# EAGLE design r2 (EAGLE 9.6.2)
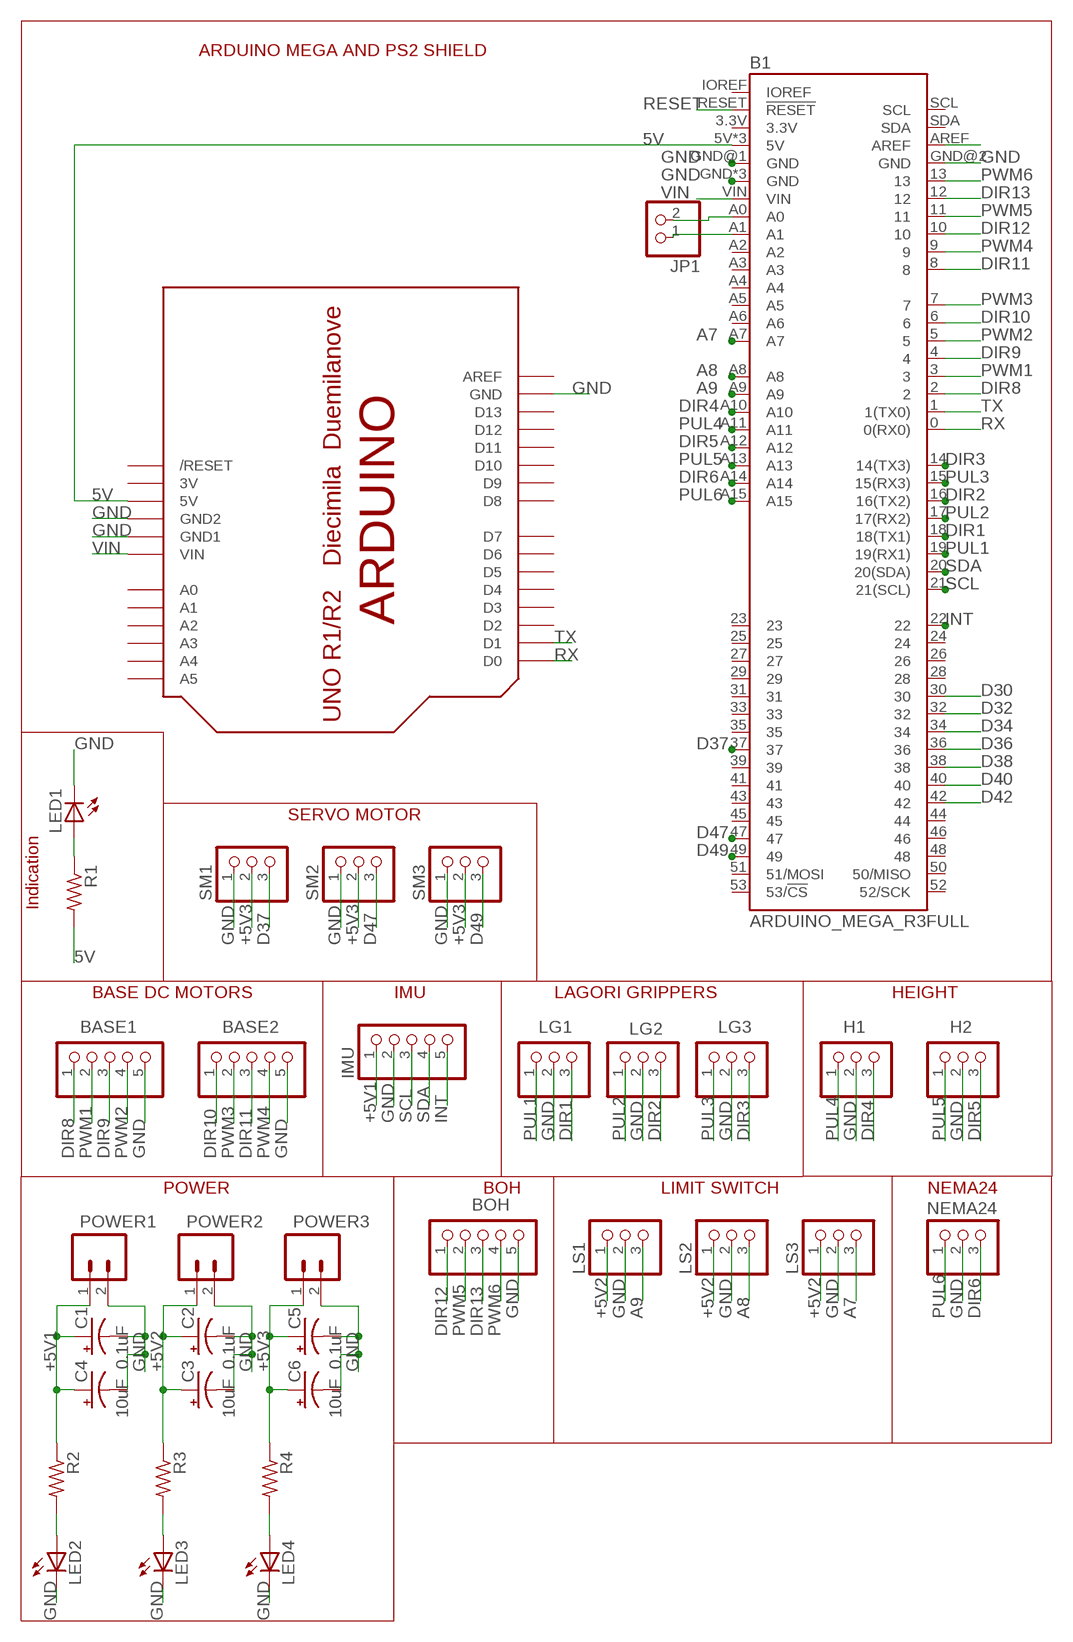
[diagram p0: schematic, sheet 1]

## Parts
B1  ARDUINO_MEGA_R3FULL  [ARDUINO_MEGA_NO_SILK]
BASE1  PINHD-1X5  [1X05]
BASE2  PINHD-1X5  [1X05]
BOH  PINHD-1X5  [1X05]
C1  0.1uF  CPOL-USE2-5  [E2-5]
C2  0.1uF  CPOL-USE2-5  [E2-5]
C3  10uF  CPOL-USE2-5  [E2-5]
C4  10uF  CPOL-USE2-5  [E2-5]
C5  0.1uF  CPOL-USE2-5  [E2-5]
C6  10uF  CPOL-USE2-5  [E2-5]
H1  PINHD-1X3  [1X03]
H2  PINHD-1X3  [1X03]
IMU  PINHD-1X5  [1X05]
JP1  PINHD-1X2  [1X02]
LED1  LED3MM  [LED3MM]
LED2  LED3MM  [LED3MM]
LED3  LED3MM  [LED3MM]
LED4  LED3MM  [LED3MM]
LG1  PINHD-1X3  [1X03]
LG2  PINHD-1X3  [1X03]
LG3  PINHD-1X3  [1X03]
LS1  PINHD-1X3  [1X03]
LS2  PINHD-1X3  [1X03]
LS3  PINHD-1X3  [1X03]
NEMA24  PINHD-1X3  [1X03]
POWER1  CONN_02  [1X02]
POWER2  CONN_02  [1X02]
POWER3  CONN_02  [1X02]
R1  R-US_0204/5  [0204/5]
R2  R-US_0204/5  [0204/5]
R3  R-US_0204/5  [0204/5]
R4  R-US_0204/5  [0204/5]
SM1  PINHD-1X3  [1X03]
SM2  PINHD-1X3  [1X03]
SM3  PINHD-1X3  [1X03]
U$1  ARDUINO-NOHOLE  [ARDUINO-NOHOLE]

## Nets
5V: B1.5V B1.5V@1(5V) B1.5V@2(5V) R1.2 U$1.5V
+5V1: C1.+ C4.+ IMU.1 POWER1.1 R2.1
+5V2: C2.+ C3.+ LS1.1 LS2.1 LS3.1 POWER2.1 R3.1
+5V3: C5.+ C6.+ POWER3.1 R4.1 SM1.2 SM2.2 SM3.2
A7: B1.A7 LS3.3
A8: B1.A8 LS2.3
A9: B1.A9 LS1.3
D30: B1.30
D32: B1.32
D34: B1.34
D36: B1.36
D37: B1.37 SM1.3
D38: B1.38
D40: B1.40
D42: B1.42
D47: B1.47 SM2.3
D49: B1.49 SM3.3
DIR1: B1.18(18(TX1)) LG1.3
DIR2: B1.16(16(TX2)) LG2.3
DIR3: B1.14(14(TX3)) LG3.3
DIR4: B1.A10 H1.3
DIR5: B1.A12 H2.3
DIR6: B1.A14 NEMA24.3
DIR8: B1.2 BASE1.1
DIR9: B1.4 BASE1.3
DIR10: B1.6 BASE2.1
DIR11: B1.8 BASE2.3
DIR12: B1.10 BOH.1
DIR13: B1.12 BOH.3
GND: B1.GND B1.GND@1(GND) B1.GND@2(GND) B1.GND@3(GND) B1.GND@4(GND) BASE1.5 BASE2.5 BOH.5 C1.- C2.- C3.- C4.- C5.- C6.- H1.2 H2.2 IMU.2 LED1.K(C) LED2.K(C) LED3.K(C) LED4.K(C) LG1.2 LG2.2 LG3.2 LS1.2 LS2.2 LS3.2 NEMA24.2 POWER1.2 POWER2.2 POWER3.2 SM1.1 SM2.1 SM3.1 U$1.GND U$1.GND1 U$1.GND2
INT: B1.22 IMU.5
N$1: LED1.A R1.1
N$2: B1.A0 JP1.2
N$3: B1.A1 JP1.1
N$10: LED3.A R3.2
N$11: LED4.A R4.2
N$23: B1.AREF
N$25: LED2.A R2.2
PUL1: B1.19(19(RX1)) LG1.1
PUL2: B1.17(17(RX2)) LG2.1
PUL3: B1.15(15(RX3)) LG3.1
PUL4: B1.A11 H1.1
PUL5: B1.A13 H2.1
PUL6: B1.A15 NEMA24.1
PWM1: B1.3 BASE1.2
PWM2: B1.5 BASE1.4
PWM3: B1.7 BASE2.2
PWM4: B1.9 BASE2.4
PWM5: B1.11 BOH.2
PWM6: B1.13 BOH.4
RESET: B1.RESET(!RESET)
RX: B1.0(0(RX0)) U$1.D0
SCL: B1.21(21(SCL)) IMU.3
SDA: B1.20(20(SDA)) IMU.4
TX: B1.1(1(TX0)) U$1.D1
VIN: B1.VIN U$1.VIN
Unconnected: B1.3.3V B1.23 B1.24 B1.25 B1.26 B1.27 B1.28 B1.29 B1.31 B1.33 B1.35 B1.39 B1.41 B1.43 B1.44 B1.45 B1.46 B1.48 B1.50(50/MISO) B1.51(51/MOSI) B1.52(52/SCK) B1.53(53/!CS) B1.A2 B1.A3 B1.A4 B1.A5 B1.A6 B1.IOREF B1.SCL B1.SDA U$1.A0 U$1.A1 U$1.A2 U$1.A3 U$1.A4 U$1.A5 U$1.AREF U$1.D2 U$1.D3 U$1.D4 U$1.D5 U$1.D6 U$1.D7 U$1.D8 U$1.D9 U$1.D10 U$1.D11 U$1.D12 U$1.D13 U$1.RESET(/RESET)

## Notes on the sheet
- ARDUINO MEGA AND PS2 SHIELD
- SERVO MOTOR
- Indication
- BASE DC MOTORS | IMU | LAGORI GRIPPERS | HEIGHT
- POWER | BOH | LIMIT SWITCH | NEMA24

## Power pins joined to a net without a drawn wire
3V: U$1.3V

## Library data of the parts
B1 = SparkFun-Boards:ARDUINO_MEGA_R3: Arduino Mega R3 ATmega2560 R3 compatible footprint. SparkFun Products: Arduino Mega 2560 R3 <https://www.sparkfun.com/products/11061>
BASE1 BASE2 BOH IMU = pinhead:PINHD-1X5: PIN HEADER
C1-C6 = rcl:CPOL-US: POLARIZED CAPACITOR, American symbol; SPICEPREFIX: C
H1 H2 LG1-LG3 LS1-LS3 NEMA24 SM1-SM3 = pinhead:PINHD-1X3: PIN HEADER
JP1 = pinhead:PINHD-1X2: PIN HEADER
LED1-LED4 = adafruit:LED: LED OSRAM: - CHIPLED LG R971, LG N971, LY N971, LG Q971, LY Q971, LO R971, LY R971 LH N974, LH R974 LS Q976, LO Q976, LY Q976 LO Q996 - Hyper CHIPLED LW Q18S LB Q993, LB Q99A, LB R99A - SideLED LS A670, LO A670, LY A670, LG A670, LP A670 LB A673, LV A673, LT A673, LW A673 LH A674 LY A675 LS A676, LA A676, LO A676, LY A676, LW A676 LS A679, LY A679, LG A679 - Hyper Micro SIDELED® LS Y876, LA Y876, LO Y876, LY Y876 LT Y87S - SmartLED LW L88C, LW L88S LB L89C, LB L89S, LG L890 LS L89K, LO L89K, LY L89K LS L896, LA L896, LO L896, LY L896 - TOPLED LS T670, LO T670, LY T670, LG T670, LP T670 LSG T670, LSP T670, LSY T670, LOP T670, LYG T670 LG T671, LOG T671, LSG T671 LB T673, LV T673, LT T673, LW T673 LH T674 LS T676, LA T676, LO T676, LY T676, LB T676, LH T676, LSB T676, LW T676 LB T67C, LV T67C, LT T67C, LS T67K, LO T67K, LY T67K, LW E67C LS E67B, LA E67B, LO E67B, LY E67B, LB E67C, LV E67C, LT E67C LW T67C LS T679, LY T679, LG T679 LS T770, LO T770, LY T770, LG T770, LP T770 LB T773, LV T773, LT T773, LW T773 LH T774 LS E675, LA E675, LY E675, LS T675 LS T776, LA T776, LO T776, LY T776, LB T776 LHGB T686 LT T68C, LB T68C - Hyper Mini TOPLED® LB M676 - Mini TOPLED Santana® LG M470 LS M47K, LO M47K, LY M47K Source: http://www.osram.convergy.de/
POWER1-POWER3 = SparkFun-Connectors:CONN_02: Multi connection point. Often used as Generic Header-pin footprint for 0.1 inch spaced/style header connections On any of the 0.1 inch spaced packages, you can populate with these: Break Away Headers - Straight <https://www.sparkfun.com/products/116> (PRT-00116) Break Away Male Headers - Right Angle <https://www.sparkfun.com/products/553> (PRT-00553) Female Headers <https://www.sparkfun.com/products/115> (PRT-00115) Break Away Headers - Machine Pin <https://www.sparkfun.com/products/117> (PRT-00117) Break Away Female Headers - Swiss Machine Pin <https://www.sparkfun.com/products/743> (PRT-00743) For SCREWTERMINALS and SPRING TERMINALS visit here: Screw Terimnals on SparkFun.com <https://www.sparkfun.com/search/results?term=Screw+Terminals> (5mm/3.5mm/2.54mm spacing) This device is also useful as a general connection point to wire up your design to another part of your project. Our various solder wires solder well into these plated through hole pads. Hook-Up Wire - Assortment (Stranded, 22 AWG) <https://www.sparkfun.com/products/11375> (PRT-11375) Hook-Up Wire - Assortment (Solid Core, 22 AWG) <https://www.sparkfun.com/products/11367> (PRT-11367) View the entire wire category on our website here <https://www.sparkfun.com/categories/141> Special notes: Molex polarized connector foot print use with: PRT-08233 with associated crimp pins and housings. 2.54_SCREWTERM for use with PRT-10571. 3.5mm Screw Terminal footprints for PRT-08084 5mm Screw Terminal footprints for use with PRT-08432
R1-R4 = rcl:R-US_: RESISTOR, American symbol; SPICEPREFIX: R
U$1 = adafruit:ARDUINO: Arduino Diecimila/Duemilanove Make a shield with ease, this package has all the named pins as well as the two mounting drill holes and an outline of the USB and DC power connector. The outline is on the DIMENSION layer, so if your board house uses it they will cut the outline to match. http://www.ladyada.net/library/pcb/eaglelibrary.html

## Board
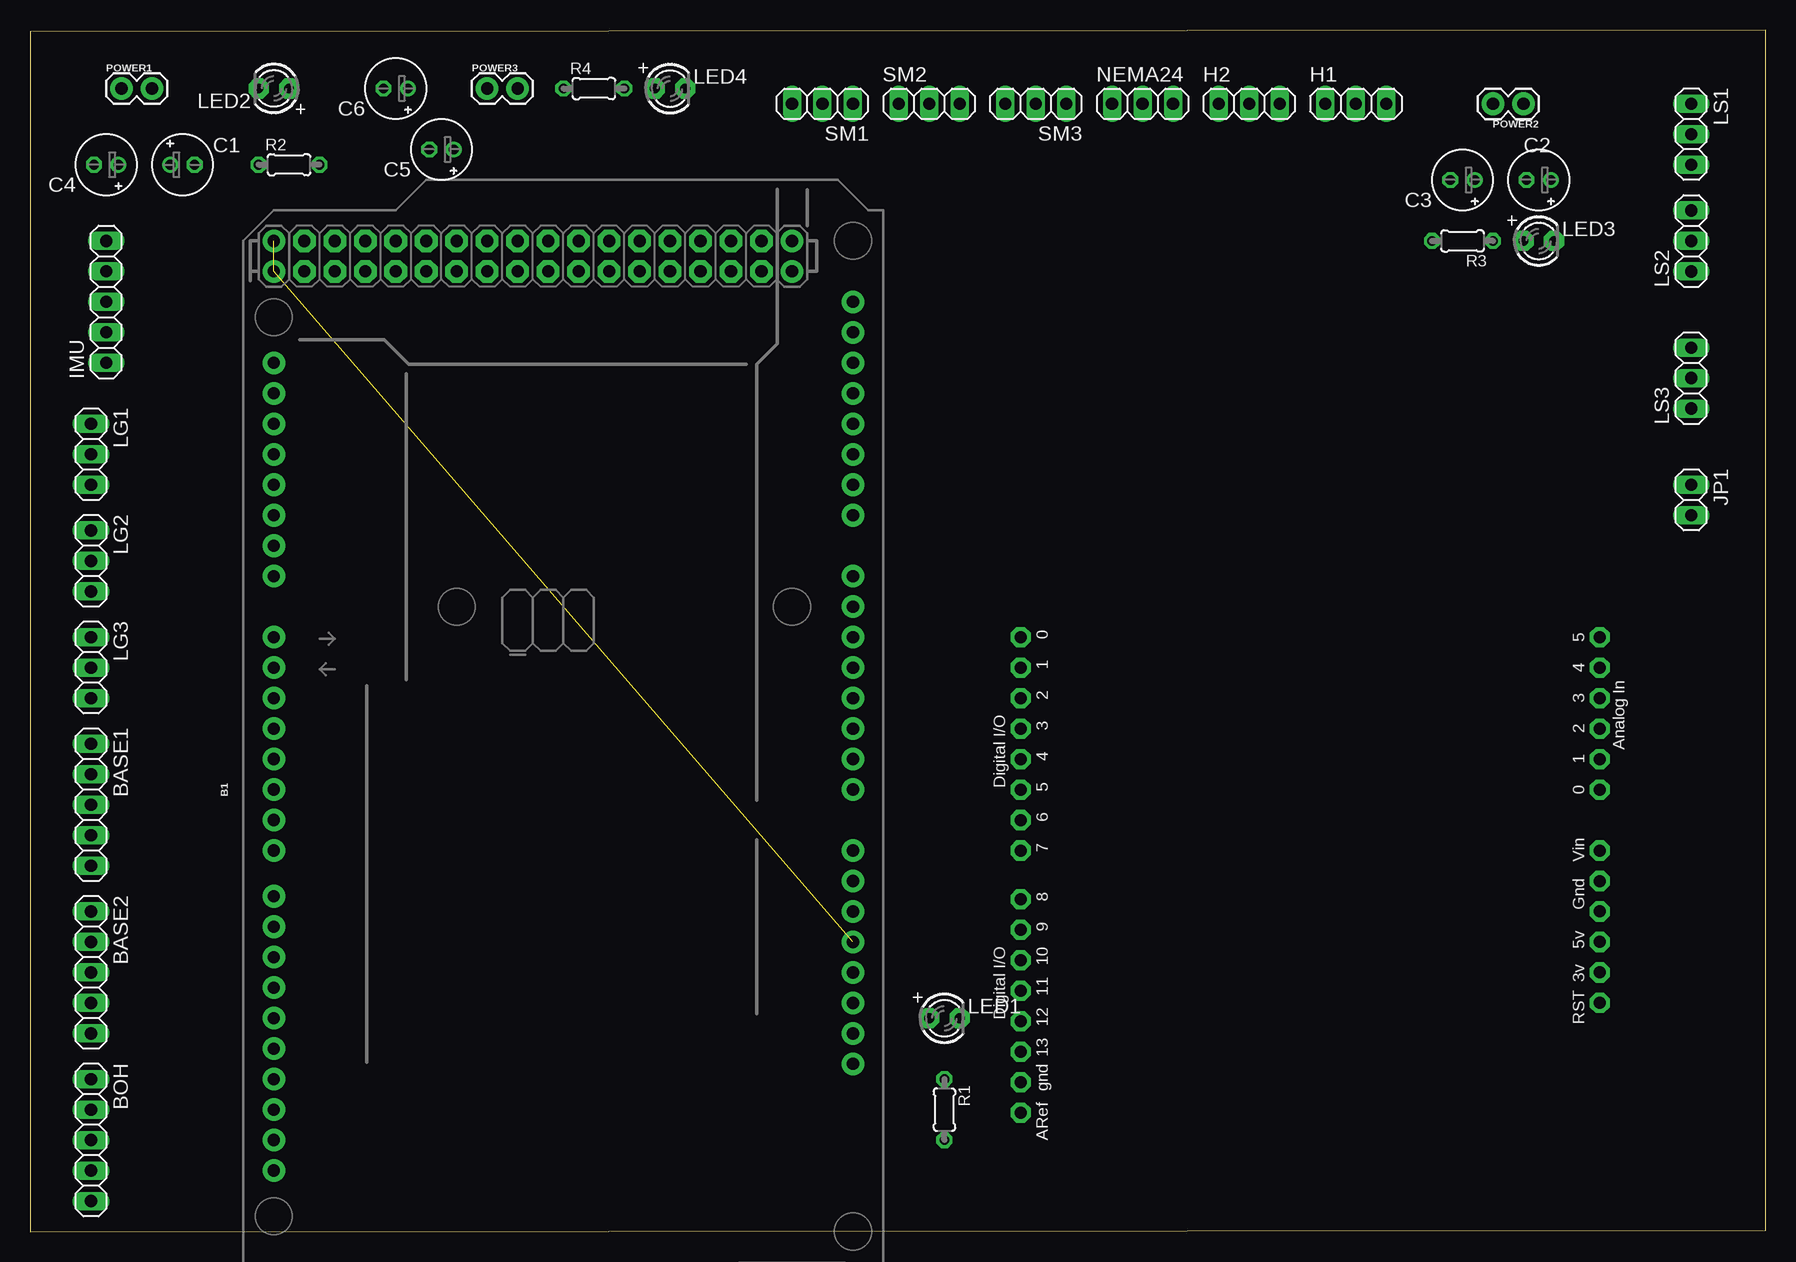
[diagram p1: board, top side]
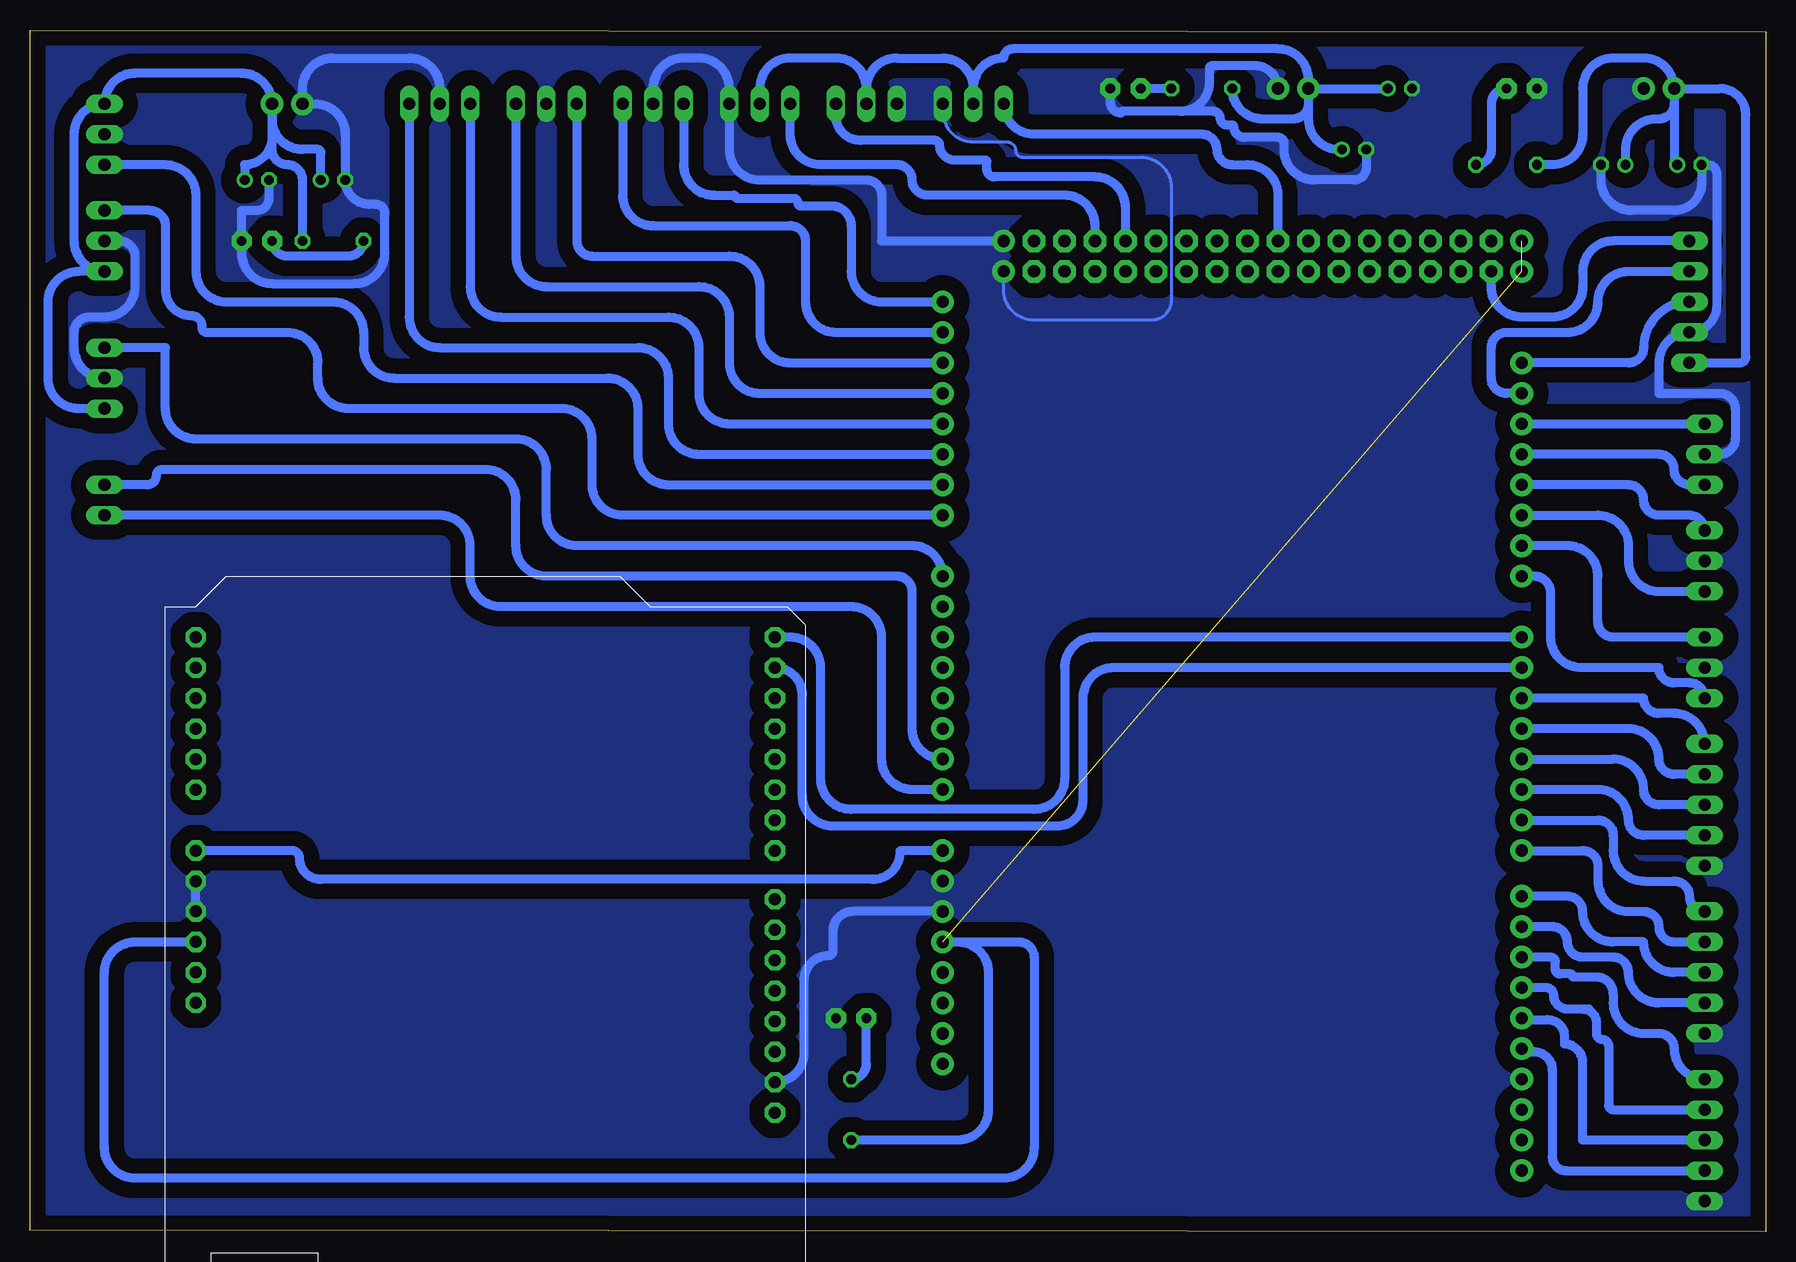
[diagram p2: board, bottom side, seen from below]

Size 144.63 x 100.13 mm. Coordinates in mm from the lower left corner, seen from the top.
Outline: 0,0 144.63,0.13 144.63,100.13 0,100 0,0
Copper layers (1*16): Top 0.035mm / dielectric 1.5mm / Bottom 0.035mm
Design rules "default": minimum track width 6mil, minimum drill 0.35mm, track to track 6mil, track to pad 6mil, pad to pad 6mil, via to via 6mil, smd to smd 6mil, copper to edge 40mil, drill to drill 6mil, minimum pad ring 10mil, minimum via ring 8mil, stop-mask expansion 4mil, vias tented up to drill 0mil, thermal gap 10mil

### Footprints (pad centres in the part's own frame; a part is rotated, then mirrored left to right if it is on the bottom)
ARDUINO_MEGA_NO_SILK = drill 1.016 pad 1.88: 0 13.97,24.13; 1 11.43,24.13; 2 8.89,24.13; 3 6.35,24.13; 3.3V -13.97,-24.13; 4 3.81,24.13; 5 1.27,24.13; 5V -11.43,-24.13; 5V@1 44.45,24.13; 5V@2 46.99,24.13; 6 -1.27,24.13; 7 -3.81,24.13; 8 -7.62,24.13; 9 -10.16,24.13; 10 -12.7,24.13; 11 -15.24,24.13; 12 -17.78,24.13; 13 -20.32,24.13; 14 19.05,24.13; 15 21.59,24.13; 16 24.13,24.13; 17 26.67,24.13; 18 29.21,24.13; 19 31.75,24.13; 20 34.29,24.13; 21 36.83,24.13; A0 1.27,-24.13; A1 3.81,-24.13; A2 6.35,-24.13; A3 8.89,-24.13; A4 11.43,-24.13; A5 13.97,-24.13; A6 16.51,-24.13; A7 19.05,-24.13; A8 24.13,-24.13; A9 26.67,-24.13; A10 29.21,-24.13; A11 31.75,-24.13; A12 34.29,-24.13; A13 36.83,-24.13; A14 39.37,-24.13; A15 41.91,-24.13; AREF -25.4,24.13; GND -8.89,-24.13; GND@1 -6.35,-24.13; GND@2 44.45,-19.05; GND@3 46.99,-19.05; GND@4 -22.86,24.13; IOREF -19.05,-24.13; NC -21.59,-24.13; RESET -16.51,-24.13; SCL -30.48,24.13; SDA -27.94,24.13; VIN -3.81,-24.13 | drill 1.016 pad 1.88 octagon: 22 44.45,21.59; 23 46.99,21.59; 24 44.45,19.05; 25 46.99,19.05; 26 44.45,16.51; 27 46.99,16.51; 28 44.45,13.97; 29 46.99,13.97; 30 44.45,11.43; 31 46.99,11.43; 32 44.45,8.89; 33 46.99,8.89; 34 44.45,6.35; 35 46.99,6.35; 36 44.45,3.81; 37 46.99,3.81; 38 44.45,1.27; 39 46.99,1.27; 40 44.45,-1.27; 41 46.99,-1.27; 42 44.45,-3.81; 43 46.99,-3.81; 44 44.45,-6.35; 45 46.99,-6.35; 46 44.45,-8.89; 47 46.99,-8.89; 48 44.45,-11.43; 49 46.99,-11.43; 50 44.45,-13.97; 51 46.99,-13.97; 52 44.45,-16.51; 53 46.99,-16.51
1X05 = drill 1.016 long: 1 -5.08,0; 2 -2.54,0; 3 0,0; 4 2.54,0; 5 5.08,0
E2-5 = drill 0.813 pad 1.27: + -1.016,0 | drill 0.813 pad 1.27 octagon: - 1.016,0
1X03 = drill 1.016 long: 1 -2.54,0; 2 0,0; 3 2.54,0
1X02 = drill 1.016 long: 1 -1.27,0; 2 1.27,0
LED3MM = drill 0.813 pad 1.676 octagon: A -1.27,0; K 1.27,0
1X02' = drill 1.016 pad 1.88: 1 0,0; 2 2.54,0
0204/5 = drill 0.813 octagon: 1 -2.54,0; 2 2.54,0
ARDUINO-NOHOLE = drill 1 pad 1.676 octagon: 3V 35.56,2.54; 5V 38.1,2.54; A0 50.8,2.54; A1 53.34,2.54; A2 55.88,2.54; A3 58.42,2.54; A4 60.96,2.54; A5 63.5,2.54; AREF 23.876,50.8; D0 63.5,50.8; D1 60.96,50.8; D2 58.42,50.8; D3 55.88,50.8; D4 53.34,50.8; D5 50.8,50.8; D6 48.26,50.8; D7 45.72,50.8; D8 41.656,50.8; D9 39.116,50.8; D10 36.576,50.8; D11 34.036,50.8; D12 31.496,50.8; D13 28.956,50.8; GND 26.416,50.8; GND1 43.18,2.54; GND2 40.64,2.54; RESET 33.02,2.54; VIN 45.72,2.54

### Placement (x,y rotation side)
B1  44.45,35.56 90 top
BASE1  5.08,35.56 270 top
BASE2  5.08,21.59 270 top
BOH  5.08,7.62 270 top
C1  12.7,88.9 0 top
C2  125.73,87.63 180 top
C3  119.38,87.63 180 top
C4  6.35,88.9 180 top
C5  34.29,90.17 180 top
C6  30.48,95.25 180 top
H1  110.49,93.98 0 top
H2  101.6,93.98 0 top
IMU  6.35,77.47 90 top
JP1  138.43,60.96 270 top
LED1  76.2,17.78 0 top
LED2  20.32,95.25 180 top
LED3  125.73,82.55 0 top
LED4  53.34,95.25 0 top
LG1  5.08,64.77 270 top
LG2  5.08,55.88 270 top
LG3  5.08,46.99 270 top
LS1  138.43,91.44 270 top
LS2  138.43,82.55 90 top
LS3  138.43,71.12 90 top
NEMA24  92.71,93.98 0 top
POWER1  [1X02']  7.62,95.25 0 top
POWER2  [1X02']  124.46,93.98 180 top
POWER3  [1X02']  38.1,95.25 0 top
R1  76.2,10.16 270 top
R2  21.59,88.9 0 top
R3  119.38,82.55 180 top
R4  46.99,95.25 0 top
SM1  66.04,93.98 180 top
SM2  74.93,93.98 0 top
SM3  83.82,93.98 180 top
U$1  133.35,-13.97 90 top

### Tracks (layer width: path | path; a pad name or v marks a point on that pad's centre or on a via)
5V  (2 unrouted)
  Bottom 0.762: R1.2 67.31,7.62 arc-90 64.77,10.16 64.77,21.59 arc-90 67.31,24.13 B1.5V 62.23,24.13 arc90 60.96,22.86 60.96,6.99 arc90 63.5,4.45 135.89,4.45 arc90 138.43,6.99 138.43,21.59 arc90 135.89,24.13 U$1.5V
+5V1
  Bottom 0.762: POWER1.1 7.62,89.15 arc-90 C4.+ | POWER1.1 7.62,93.98 arc90 8.89,92.71 9.14,92.71 arc-90 11.68,90.17 C1.+ | POWER1.1 arc-90 10.16,97.79 12.7,97.79 arc-90 15.24,95.25 15.24,91.44 arc90 17.78,88.9 R2.1 | POWER1.1 3.81,95.25 arc90 1.65,93.09 1.65,72.9 arc90 2.16,72.39 IMU.1
+5V2
  Bottom 0.762: C3.+ 120.4,89.92 arc-90 120.65,90.17 121.92,90.17 arc90 124.46,92.71 POWER2.1 | C2.+ 126.75,88.9 arc-90 124.46,91.19 POWER2.1 | LS2.1 arc90 140.97,82.55 140.97,91.44 arc90 LS1.1 arc90 135.89,96.52 127,96.52 arc90 POWER2.1 | POWER2.1 124.46,90.17 arc-90 123.19,88.9 arc90 121.92,87.63 R3.1 | LS2.1 139.7,80.01 | 139.7,68.58 LS3.1 140.59,68.58 arc90 143.13,71.12 143.13,77.47 arc90 140.59,80.01 LS2.1
+5V3
  Bottom 0.762: POWER3.1 38.1,93.98 arc90 39.37,92.71 41.91,92.71 arc90 R4.1 | 74.93,95.25 arc90 72.39,97.79 68.58,97.79 arc90 66.04,95.25 | 74.93,95.25 arc-90 77.47,97.79 81.28,97.79 arc-90 83.82,95.25 SM3.2 | POWER3.1 38.1,92.71 arc-90 35.56,90.17 C5.+ | POWER3.1 C6.+ | 66.04,95.25 arc90 63.5,97.79 arc90 62.74,98.55 40.64,98.55 arc90 38.1,96.01 POWER3.1 | 66.04,95.25 SM1.2 | SM2.2 74.93,95.25
A7
  Bottom 0.762: B1.A7 arc-90 71.12,57.15 99.06,57.15 arc90 101.6,59.69 101.6,63.5 arc-90 104.14,66.04 130.81,66.04 arc90 133.35,68.58 133.35,73.66 LS3.3
A8
  Bottom 0.762: LS2.3 134.62,85.09 arc90 133.35,83.82 133.35,78.49 arc-90 131.19,76.33 arc90 130.3,75.44 130.3,75.31 arc-90 129.92,74.93 123.19,74.93 arc90 120.65,72.39 120.65,71.12 arc-90 118.11,68.58 100.33,68.58 arc90 97.79,66.04 97.79,62.23 arc-90 95.25,59.69 B1.A8
A9
  Bottom 0.762: LS1.3 133.35,88.9 arc90 130.81,86.36 130.81,80.01 arc-90 128.27,77.47 119.38,77.47 arc90 116.84,74.93 116.84,73.66 arc-90 114.3,71.12 96.52,71.12 arc90 93.98,68.58 93.98,64.77 arc-90 91.44,62.23 B1.A9
D37
  Bottom 0.762: B1.37 40.64,86.36 arc-90 43.18,88.9 44.45,88.9 arc90 45.72,90.17 arc-90 46.99,91.44 60.96,91.44 arc90 SM1.3
D47
  Bottom 0.762: B1.47 53.34,85.34 arc-90 55.88,87.88 64.26,87.88 arc90 64.9,88.52 64.9,89.15 arc-90 65.02,89.28 67.56,89.28 arc90 68.83,90.55 arc-90 69.22,90.93 75.44,90.93 arc90 77.47,92.96 SM2.3
D49
  Bottom 0.762: B1.49 55.88,83.82 arc-90 58.42,86.36 69.85,86.36 arc90 71.12,87.63 arc-90 72.39,88.9 78.74,88.9 arc90 81.28,91.44 SM3.3
DIR1
  Bottom 0.762: LG1.3 6.35,62.23 arc90 7.62,63.5 arc-90 8.89,64.77 B1.18
DIR2
  Bottom 0.762: LG2.3 8.89,53.34 arc90 11.43,55.88 11.43,57.15 arc-90 13.97,59.69 B1.16
DIR3
  Bottom 0.762: B1.14 19.3,54.61 arc90 17.91,53.21 17.91,49.53 arc-90 15.37,46.99 8.89,46.99 arc-90 7.62,45.72 6.35,45.72 arc90 LG3.3
DIR4
  Bottom 0.762: B1.A10 88.9,64.77 arc90 91.44,67.31 91.44,71.12 arc-90 93.98,73.66 110.49,73.66 arc90 113.03,76.2 H1.3
DIR5
  Bottom 0.762: B1.A12 83.82,69.85 arc90 86.36,72.39 86.36,76.2 arc-90 88.9,78.74 101.6,78.74 arc90 104.14,81.28 H2.3
DIR6
  Bottom 0.762: NEMA24.3 95.25,86.36 arc-90 92.71,83.82 81.28,83.82 arc90 80.01,82.55 80.01,77.47 arc-90 77.47,74.93 B1.A14
DIR8
  Bottom 0.762: BASE1.1 arc-90 7.62,43.18 8.89,43.18 arc90 10.16,44.45 B1.2
DIR9
  Bottom 0.762: 5.21,35.56 BASE1.3 8.89,35.56 arc90 10.16,36.83 arc-90 12.7,39.37 B1.4
DIR10
  Bottom 0.762: B1.6 13.97,34.29 arc90 12.7,33.02 12.7,31.75 arc-90 10.16,29.21 7.62,29.21 arc90 6.35,27.94 arc-90 BASE2.1
DIR11
  Bottom 0.762: BASE2.3 7.62,21.59 arc90 10.16,24.13 12.7,24.13 arc90 15.24,26.67 arc-90 16.51,27.94 B1.8
DIR12
  Bottom 0.762: B1.10 17.91,22.86 arc90 17.53,22.48 17.53,21.84 arc-90 17.14,21.46 16.26,21.46 arc90 16.13,21.34 arc-90 16,21.21 14.1,21.21 arc90 12.7,19.81 12.7,19.05 arc-90 10.16,16.51 8.89,16.51 arc90 7.62,15.24 arc-90 BOH.1
DIR13
  Bottom 0.762: B1.12 arc-90 20.19,17.65 18.16,17.65 arc90 16.76,16.26 16.76,15.62 arc90 15.24,14.1 15.24,7.62 BOH.3
GND
  Bottom 0.254: SM1.1 68.58,93.34 arc-90 66.04,90.81 63.25,90.81 arc90 62.48,90.04 arc-90 61.98,89.53 52.07,89.53 arc90 49.53,87 49.53,77.6 arc90 51.18,75.95 60.96,75.95 arc90 63.5,78.49 B1.GND@2
  Bottom 0.762: B1.GND 76.07,26.67 arc-90 77.72,25.02 77.72,23.37 arc90 78.11,22.99 arc-90 80.14,20.95 80.14,14.86 arc90 U$1.GND | LG1.2 3.81,64.77 arc-90 2.54,66.04 2.54,68.58 arc-90 3.81,69.85 8.89,69.85 8.89,72.39 arc90 IMU.2 arc-90 4.06,77.22 4.06,88.14 arc-90 4.83,88.9 C4.- 5.33,87.38 arc90 7.62,85.09 11.18,85.09 arc90 13.72,87.63 C1.- | H1.2 110.49,95.25 arc-90 113.03,97.79 119.38,97.79 arc-90 121.92,95.25 POWER2.2 120.9,93.98 arc90 118.36,91.44 C3.- arc-90 116.33,85.6 115.82,85.6 arc90 115.06,84.84 115.06,81.53 arc90 117.6,78.99 124.46,78.99 arc90 127,81.53 LED3.K 127,85.09 125.73,85.09 arc-90 124.71,86.11 C2.- | U$1.GND2 U$1.GND1 | LS2.2 137.16,82.55 arc90 135.89,81.28 135.89,78.74 arc90 138.43,76.2 139.7,76.2 arc-90 140.97,74.93 140.97,73.66 arc-90 LS3.2 | NEMA24.2 92.71,95.25 arc90 90.17,97.79 88.9,97.79 arc90 86.36,95.25 SM3.1 86.36,90.17 arc-90 83.82,87.63 74.93,87.63 arc90 73.66,86.36 73.66,82.55 B1.GND@3 | POWER3.2 arc-90 42.55,97.16 46.1,97.16 arc-90 46.35,96.9 46.35,95.76 arc90 48.77,93.34 | 48.77,93.34 53.59,93.34 arc-90 53.72,93.22 arc90 54.61,94.11 LED4.K | C5.- 33.27,88.65 arc90 34.29,87.63 37.59,87.63 arc90 40.13,90.17 40.13,90.68 arc-90 40.64,91.19 43.43,91.19 arc90 44.32,92.08 arc-90 44.45,92.2 44.83,92.2 arc90 45.47,92.84 arc-90 45.97,93.34 48.77,93.34
  pour Bottom (isolate 1.27, no thermals): -2.54,100.33 -2.54,-2.54 147.32,-2.54 147.32,99.06 146.05,100.33 142.24,104.14 1.27,104.14
INT
  Bottom 0.762: B1.22 22.86,78.74 arc-90 20.32,76.2 17.78,76.2 arc-90 15.24,78.74 15.24,80.01 arc90 12.7,82.55 IMU.5
N$1
  Bottom 0.762: R1.1 arc-90 74.93,13.97 LED1.A
N$2
  Bottom 0.762: JP1.2 110.49,59.69 arc90 107.95,57.15 107.95,54.61 arc-90 105.41,52.07 76.2,52.07 arc90 73.66,49.53 73.66,39.37 arc-90 71.12,36.83 B1.A0
N$3
  Bottom 0.762: B1.A1 arc90 71.12,41.91 71.12,53.34 arc-90 72.39,54.61 101.6,54.61 arc90 104.14,57.15 104.14,60.96 arc-90 106.68,63.5 133.6,63.5 arc-90 134.11,62.99 arc90 134.87,62.23 JP1.1
N$10
  Bottom 0.762: R3.2 arc90 118.11,81.28 123.19,81.28 arc90 LED3.A
N$11
  Bottom 0.762: R4.2 LED4.A
N$25
  Bottom 0.762: LED2.A arc-90 22.86,93.98 22.86,90.17 arc90 R2.2
PUL1
  Bottom 0.762: B1.19 LG1.1
PUL2
  Bottom 0.762: LG2.1 arc-90 6.35,59.69 8.89,59.69 arc90 10.16,60.96 arc-90 11.43,62.23 B1.17
PUL3
  Bottom 0.762: LG3.1 12.7,49.53 arc90 13.97,50.8 13.97,54.61 arc-90 16.51,57.15 B1.15
PUL4
  Bottom 0.762: H1.1 107.95,78.74 arc-90 105.41,76.2 91.44,76.2 arc90 88.9,73.66 88.9,69.85 arc-90 86.36,67.31 B1.A11
PUL5
  Bottom 0.762: H2.1 99.06,82.55 arc-90 97.79,81.28 86.36,81.28 arc90 83.82,78.74 83.82,74.93 arc-90 81.28,72.39 B1.A13
PUL6
  Bottom 0.762: NEMA24.1 90.17,88.9 arc-90 87.63,86.36 85.98,86.36 arc90 85.85,86.23 arc-90 85.72,86.11 81.03,86.11 arc90 80.64,85.72 arc-90 80.39,85.47 77.85,85.47 arc90 76.2,83.82 76.2,80.01 arc-90 73.66,77.47 B1.A15
PWM1
  Bottom 0.762: BASE1.2 7.62,38.1 arc90 8.89,39.37 arc-90 11.43,41.91 B1.3
PWM2
  Bottom 0.762: B1.5 13.97,36.83 arc90 11.43,34.29 arc-90 10.16,33.02 BASE1.4
PWM3
  Bottom 0.762: B1.7 15.24,31.75 arc90 13.97,30.48 13.97,29.21 arc-90 11.43,26.67 10.16,26.67 arc90 8.89,25.4 arc-90 7.62,24.13 BASE2.2
PWM4
  Bottom 0.762: BASE2.4 8.89,19.05 arc90 11.43,21.59 arc-90 12.7,22.86 15.24,22.86 arc90 16.51,24.13 arc-90 17.78,25.4 B1.9
PWM5
  Bottom 0.762: B1.11 18.29,20.32 arc90 17.65,19.68 arc-90 16.51,18.54 15.24,18.54 | 14.73,18.54 15.24,18.54 | 15.24,18.54 arc90 14.1,17.4 14.1,16.51 arc-90 13.59,16 arc90 13.08,15.49 13.08,10.54 arc-90 12.7,10.16 BOH.2
PWM6
  Bottom 0.762: B1.13 arc-90 20.07,14.99 19.3,14.99 arc90 17.78,13.46 17.78,6.22 arc-90 16.64,5.08 BOH.4
RX
  Bottom 0.762: B1.0 55.88,49.53 arc-90 58.42,46.99 58.42,37.72 arc90 60.96,35.18 76.2,35.18 arc90 78.74,37.72 78.74,46.99 arc-90 81.28,49.53 U$1.D0
SCL
  Bottom 0.762: IMU.3 arc-90 10.16,73.66 arc90 11.43,72.39 B1.21
SDA
  Bottom 0.762: B1.20 21.59,69.85 arc90 22.86,71.12 22.86,73.66 arc90 21.59,74.93 16.51,74.93 arc-90 13.97,77.47 arc90 11.43,80.01 IMU.4
TX
  Bottom 0.762: B1.1 54.36,46.99 arc-90 56.9,44.45 56.9,35.94 arc90 59.05,33.78 77.72,33.78 arc90 80.26,36.32 80.26,44.7 arc-90 U$1.D1
VIN
  Bottom 0.762: B1.VIN 72.01,31.75 arc-90 72.14,31.62 arc90 74.42,29.34 120.4,29.34 arc90 122.17,31.11 arc-90 122.81,31.75 U$1.VIN